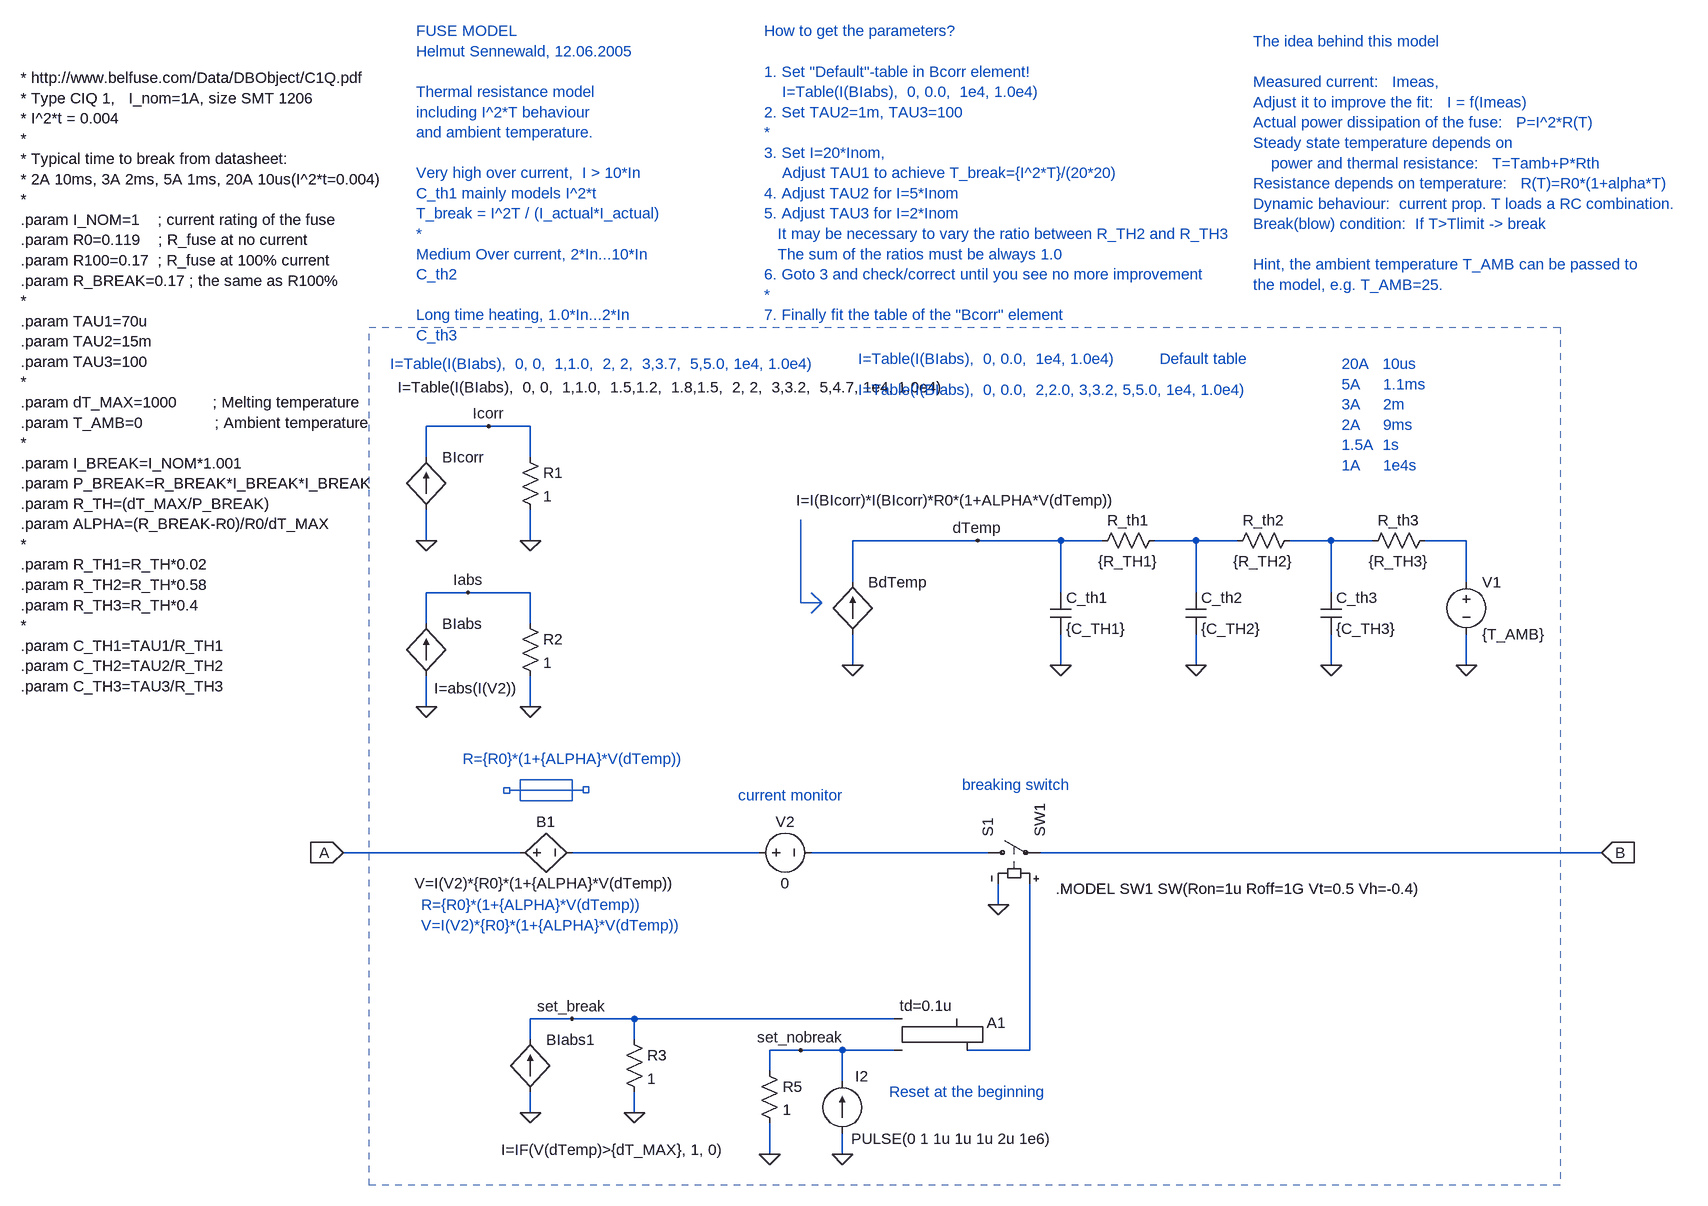
[diagram p0: schematic belfuse_C1Q_1A.asc]
belfuse_C1Q_1A.asc, the LTspice schematic file:
Version 4
SHEET 1 2036 932
WIRE -96 -528 -96 -576
WIRE -96 -400 -96 -448
WIRE -96 -272 -96 -320
WIRE -96 -144 -96 -192
WIRE -32 -320 -96 -320
WIRE 0 -576 -96 -576
WIRE 48 80 -224 80
WIRE 64 -576 0 -576
WIRE 64 -528 64 -576
WIRE 64 -400 64 -448
WIRE 64 -320 -32 -320
WIRE 64 -272 64 -320
WIRE 64 -144 64 -192
WIRE 64 368 64 336
WIRE 64 480 64 448
WIRE 128 336 64 336
WIRE 224 336 128 336
WIRE 224 368 224 336
WIRE 224 480 224 448
WIRE 416 80 128 80
WIRE 432 416 432 384
WIRE 432 544 432 496
WIRE 480 384 432 384
WIRE 544 384 480 384
WIRE 544 432 544 384
WIRE 544 544 544 512
WIRE 560 -336 560 -400
WIRE 560 -208 560 -256
WIRE 624 336 224 336
WIRE 624 384 544 384
WIRE 752 -400 560 -400
WIRE 768 80 496 80
WIRE 784 160 784 128
WIRE 832 384 736 384
WIRE 832 384 832 128
WIRE 880 -400 752 -400
WIRE 880 -320 880 -400
WIRE 880 -208 880 -256
WIRE 944 -400 880 -400
WIRE 1088 -400 1024 -400
WIRE 1088 -320 1088 -400
WIRE 1088 -208 1088 -256
WIRE 1152 -400 1088 -400
WIRE 1296 -400 1232 -400
WIRE 1296 -320 1296 -400
WIRE 1296 -208 1296 -256
WIRE 1360 -400 1296 -400
WIRE 1504 -400 1440 -400
WIRE 1504 -336 1504 -400
WIRE 1504 -208 1504 -256
WIRE 1712 80 848 80
FLAG 560 -208 0
FLAG 784 160 0
FLAG 544 544 0
FLAG 752 -400 dTemp
FLAG 880 -208 0
FLAG 1296 -208 0
FLAG 1088 -208 0
FLAG 64 -400 0
FLAG -96 -400 0
FLAG 0 -576 Icorr
FLAG -96 -144 0
FLAG 64 -144 0
FLAG -32 -320 Iabs
FLAG 64 480 0
FLAG 224 480 0
FLAG 128 336 set_break
FLAG 432 544 0
FLAG 480 384 set_nobreak
FLAG 1504 -208 0
FLAG -224 80 A
IOPIN -224 80 In
FLAG 1712 80 B
IOPIN 1712 80 In
SYMBOL voltage 400 80 R270
WINDOW 0 32 56 VTop 0
WINDOW 3 -32 56 VBottom 0
SYMATTR InstName V2
SYMATTR Value 0
SYMBOL bi2 560 -336 R0
WINDOW 3 -87 -126 Left 0
SYMATTR Value I=I(BIcorr)*I(BIcorr)*R0*(1+ALPHA*V(dTemp))
SYMATTR InstName BdTemp
SYMBOL res 928 -384 R270
WINDOW 0 32 56 VTop 0
WINDOW 3 0 56 VBottom 0
SYMATTR InstName R_th1
SYMATTR Value {R_TH1}
SYMBOL cap 864 -320 R0
SYMATTR InstName C_th1
SYMATTR Value {C_TH1}
SYMBOL sw 752 80 R270
SYMATTR InstName S1
SYMATTR Value SW1
SYMBOL res 1136 -384 R270
WINDOW 0 32 56 VTop 0
WINDOW 3 0 56 VBottom 0
SYMATTR InstName R_th2
SYMATTR Value {R_TH2}
SYMBOL cap 1072 -320 R0
SYMATTR InstName C_th2
SYMATTR Value {C_TH2}
SYMBOL Digital\\srflop 672 288 R0
WINDOW 123 -40 28 Left 0
SYMATTR Value2 td=0.1u
SYMATTR InstName A1
SYMBOL cap 1280 -320 R0
SYMATTR InstName C_th3
SYMATTR Value {C_TH3}
SYMBOL bi2 -96 -528 R0
WINDOW 3 -44 -108 Left 0
SYMATTR Value I=Table(I(BIabs),  0, 0,  1,1.0,  1.5,1.2,  1.8,1.5,  2, 2,  3,3.2,  5,4.7, 1e4, 1.0e4)
SYMATTR InstName BIcorr
SYMBOL res 48 -544 R0
SYMATTR InstName R1
SYMATTR Value 1
SYMBOL bi2 -96 -272 R0
WINDOW 3 12 99 Left 0
SYMATTR Value I=abs(I(V2))
SYMATTR InstName BIabs
SYMBOL res 48 -288 R0
SYMATTR InstName R2
SYMATTR Value 1
SYMBOL bi2 64 368 R0
WINDOW 3 -45 169 Left 0
SYMATTR Value I=IF(V(dTemp)>{dT_MAX}, 1, 0)
SYMATTR InstName BIabs1
SYMBOL res 208 352 R0
SYMATTR InstName R3
SYMATTR Value 1
SYMBOL current 544 512 R180
WINDOW 0 -40 88 Left 0
WINDOW 3 -324 -8 Left 0
SYMATTR InstName I2
SYMATTR Value PULSE(0 1 1u 1u 1u 2u 1e6)
SYMBOL res 416 400 R0
SYMATTR InstName R5
SYMATTR Value 1
SYMBOL res 1344 -384 R270
WINDOW 0 32 56 VTop 0
WINDOW 3 0 56 VBottom 0
SYMATTR InstName R_th3
SYMATTR Value {R_TH3}
SYMBOL bv 32 80 R270
WINDOW 0 32 56 VTop 0
WINDOW 3 -32 56 VBottom 0
SYMATTR InstName B1
SYMATTR Value V=I(V2)*{R0}*(1+{ALPHA}*V(dTemp))
SYMBOL voltage 1504 -352 R0
SYMATTR InstName V1
SYMATTR Value {T_AMB}
TEXT 872 136 Left 0 !.MODEL SW1 SW(Ron=1u Roff=1G Vt=0.5 Vh=-0.4)
TEXT -112 -1184 Left 0 ;FUSE MODEL\nHelmut Sennewald, 12.06.2005\n \nThermal resistance model \nincluding I^2*T behaviour \nand ambient temperature.\n \nVery high over current,  I > 10*In\nC_th1 mainly models I^2*t \nT_break = I^2T / (I_actual*I_actual)\n*\nMedium Over current, 2*In...10*In\nC_th2 \n \nLong time heating, 1.0*In...2*In\nC_th3
TEXT 616 448 Left 0 ;Reset at the beginning
TEXT 568 -632 Left 0 ;I=Table(I(BIabs),  0, 0.0,  2,2.0, 3,3.2, 5,5.0, 1e4, 1.0e4)
TEXT 568 -680 Left 0 ;I=Table(I(BIabs),  0, 0.0,  1e4, 1.0e4)
TEXT -104 160 Left 0 ;R={R0}*(1+{ALPHA}*V(dTemp))
TEXT -104 192 Left 0 ;V=I(V2)*{R0}*(1+{ALPHA}*V(dTemp))
TEXT 1032 -680 Left 0 ;Default table
TEXT -40 -64 Left 0 ;R={R0}*(1+{ALPHA}*V(dTemp))
TEXT 384 -8 Left 0 ;current monitor
TEXT 728 -24 Left 0 ;breaking switch
TEXT 424 -1184 Left 0 ;How to get the parameters?\n \n1. Set "Default"-table in Bcorr element!\n    I=Table(I(BIabs),  0, 0.0,  1e4, 1.0e4)\n2. Set TAU2=1m, TAU3=100\n*\n3. Set I=20*Inom, \n    Adjust TAU1 to achieve T_break={I^2*T}/(20*20)\n4. Adjust TAU2 for I=5*Inom\n5. Adjust TAU3 for I=2*Inom\n   It may be necessary to vary the ratio between R_TH2 and R_TH3\n   The sum of the ratios must be always 1.0\n6. Goto 3 and check/correct until you see no more improvement\n*\n7. Finally fit the table of the "Bcorr" element
TEXT -720 -1112 Left 0 !* http://www.belfuse.com/Data/DBObject/C1Q.pdf\n* Type CIQ 1,   I_nom=1A, size SMT 1206\n* I^2*t = 0.004  \n*\n* Typical time to break from datasheet:\n* 2A 10ms, 3A 2ms, 5A 1ms, 20A 10us(I^2*t=0.004)\n*\n.param I_NOM=1    ; current rating of the fuse\n.param R0=0.119    ; R_fuse at no current\n.param R100=0.17  ; R_fuse at 100% current\n.param R_BREAK=0.17 ; the same as R100%\n*\n.param TAU1=70u\n.param TAU2=15m\n.param TAU3=100\n*\n.param dT_MAX=1000        ; Melting temperature\n.param T_AMB=0                ; Ambient temperature\n*\n.param I_BREAK=I_NOM*1.001\n.param P_BREAK=R_BREAK*I_BREAK*I_BREAK\n.param R_TH=(dT_MAX/P_BREAK)\n.param ALPHA=(R_BREAK-R0)/R0/dT_MAX\n*\n.param R_TH1=R_TH*0.02\n.param R_TH2=R_TH*0.58\n.param R_TH3=R_TH*0.4\n*\n.param C_TH1=TAU1/R_TH1\n.param C_TH2=TAU2/R_TH2\n.param C_TH3=TAU3/R_TH3
TEXT -152 -672 Left 0 ;I=Table(I(BIabs),  0, 0,  1,1.0,  2, 2,  3,3.7,  5,5.0, 1e4, 1.0e4)
TEXT 1312 -672 Left 0 ;20A   10us\n5A     1.1ms\n3A     2m\n2A     9ms\n1.5A  1s\n1A     1e4s
TEXT 1176 -1168 Left 0 ;The idea behind this model\n \nMeasured current:   Imeas,       \nAdjust it to improve the fit:   I = f(Imeas)      \nActual power dissipation of the fuse:   P=I^2*R(T) \nSteady state temperature depends on \n    power and thermal resistance:   T=Tamb+P*Rth    \nResistance depends on temperature:   R(T)=R0*(1+alpha*T)   \nDynamic behaviour:  current prop. T loads a RC combination. \nBreak(blow) condition:  If T>Tlimit -> break\n \nHint, the ambient temperature T_AMB can be passed to\nthe model, e.g. T_AMB=25.
LINE Normal 480 -432 480 -432
LINE Normal 480 -304 480 -432
LINE Normal 512 -304 480 -304
LINE Normal 496 -320 512 -304
LINE Normal 496 -288 512 -304
LINE Normal 144 -16 32 -16
RECTANGLE Normal 1648 592 -184 -728 2
RECTANGLE Normal 128 0 48 -32
RECTANGLE Normal 154 -12 145 -21
RECTANGLE Normal 32 -11 23 -20

The netlist it stands for:
* belfuse_C1Q_1A.asc
V2 N001 N002 0
BdTemp 0 dTemp I=I(BIcorr)*I(BIcorr)*R0*(1+ALPHA*V(dTemp))
R_th1 dTemp N004 {R_TH1}
C_th1 dTemp 0 {C_TH1}
S1 N002 B N003 0 SW1
R_th2 N004 N005 {R_TH2}
C_th2 N004 0 {C_TH2}
A1 set_break set_nobreak 0 0 0 N003 0 0 SRFLOP td=0.1u
C_th3 N005 0 {C_TH3}
BIcorr 0 Icorr I=Table(I(BIabs),  0, 0,  1,1.0,  1.5,1.2,  1.8,1.5,  2, 2,  3,3.2,  5,4.7, 1e4, 1.0e4)
R1 Icorr 0 1
BIabs 0 Iabs I=abs(I(V2))
R2 Iabs 0 1
BIabs1 0 set_break I=IF(V(dTemp)>{dT_MAX}, 1, 0)
R3 set_break 0 1
I2 0 set_nobreak PULSE(0 1 1u 1u 1u 2u 1e6)
R5 set_nobreak 0 1
R_th3 N005 N006 {R_TH3}
B1 A N001 V=I(V2)*{R0}*(1+{ALPHA}*V(dTemp))
V1 N006 0 {T_AMB}
.MODEL SW1 SW(Ron=1u Roff=1G Vt=0.5 Vh=-0.4)
* FUSE MODEL
* Helmut Sennewald, 12.06.2005
* Thermal resistance model
* including I^2*T behaviour
* and ambient temperature.
* Very high over current,  I > 10*In
* C_th1 mainly models I^2*t
* T_break = I^2T / (I_actual*I_actual)
* *
* Medium Over current, 2*In...10*In
* C_th2
* Long time heating, 1.0*In...2*In
* C_th3
* Reset at the beginning
* I=Table(I(BIabs),  0, 0.0,  2,2.0, 3,3.2, 5,5.0, 1e4, 1.0e4)
* I=Table(I(BIabs),  0, 0.0,  1e4, 1.0e4)
* R={R0}*(1+{ALPHA}*V(dTemp))
* V=I(V2)*{R0}*(1+{ALPHA}*V(dTemp))
* Default table
* R={R0}*(1+{ALPHA}*V(dTemp))
* current monitor
* breaking switch
* How to get the parameters?
* 1. Set "Default"-table in Bcorr element!
*     I=Table(I(BIabs),  0, 0.0,  1e4, 1.0e4)
* 2. Set TAU2=1m, TAU3=100
* *
* 3. Set I=20*Inom,
*     Adjust TAU1 to achieve T_break={I^2*T}/(20*20)
* 4. Adjust TAU2 for I=5*Inom
* 5. Adjust TAU3 for I=2*Inom
*    It may be necessary to vary the ratio between R_TH2 and R_TH3
*    The sum of the ratios must be always 1.0
* 6. Goto 3 and check/correct until you see no more improvement
* *
* 7. Finally fit the table of the "Bcorr" element
* http://www.belfuse.com/Data/DBObject/C1Q.pdf
* Type CIQ 1,   I_nom=1A, size SMT 1206
* I^2*t = 0.004
*
* Typical time to break from datasheet:
* 2A 10ms, 3A 2ms, 5A 1ms, 20A 10us(I^2*t=0.004)
*
.param I_NOM=1    ; current rating of the fuse
.param R0=0.119    ; R_fuse at no current
.param R100=0.17  ; R_fuse at 100% current
.param R_BREAK=0.17 ; the same as R100%
*
.param TAU1=70u
.param TAU2=15m
.param TAU3=100
*
.param dT_MAX=1000        ; Melting temperature
.param T_AMB=0                ; Ambient temperature
*
.param I_BREAK=I_NOM*1.001
.param P_BREAK=R_BREAK*I_BREAK*I_BREAK
.param R_TH=(dT_MAX/P_BREAK)
.param ALPHA=(R_BREAK-R0)/R0/dT_MAX
*
.param R_TH1=R_TH*0.02
.param R_TH2=R_TH*0.58
.param R_TH3=R_TH*0.4
*
.param C_TH1=TAU1/R_TH1
.param C_TH2=TAU2/R_TH2
.param C_TH3=TAU3/R_TH3
* I=Table(I(BIabs),  0, 0,  1,1.0,  2, 2,  3,3.7,  5,5.0, 1e4, 1.0e4)
* 20A   10us
* 5A     1.1ms
* 3A     2m
* 2A     9ms
* 1.5A  1s
* 1A     1e4s
* The idea behind this model
* Measured current:   Imeas,
* Adjust it to improve the fit:   I = f(Imeas)
* Actual power dissipation of the fuse:   P=I^2*R(T)
* Steady state temperature depends on
*     power and thermal resistance:   T=Tamb+P*Rth
* Resistance depends on temperature:   R(T)=R0*(1+alpha*T)
* Dynamic behaviour:  current prop. T loads a RC combination.
* Break(blow) condition:  If T>Tlimit -> break
* Hint, the ambient temperature T_AMB can be passed to
* the model, e.g. T_AMB=25.
.backanno
.end